# Altium schematic sheet Power.SchDoc: Наименование
size 420 x 297 mm; ApprovedBy: Сидоров; CheckedBy: Петров; Author: Иванов; CompanyName: РГППУ; Title2str: Изделия; DecimalNumber: АБВГ.123456.001 33
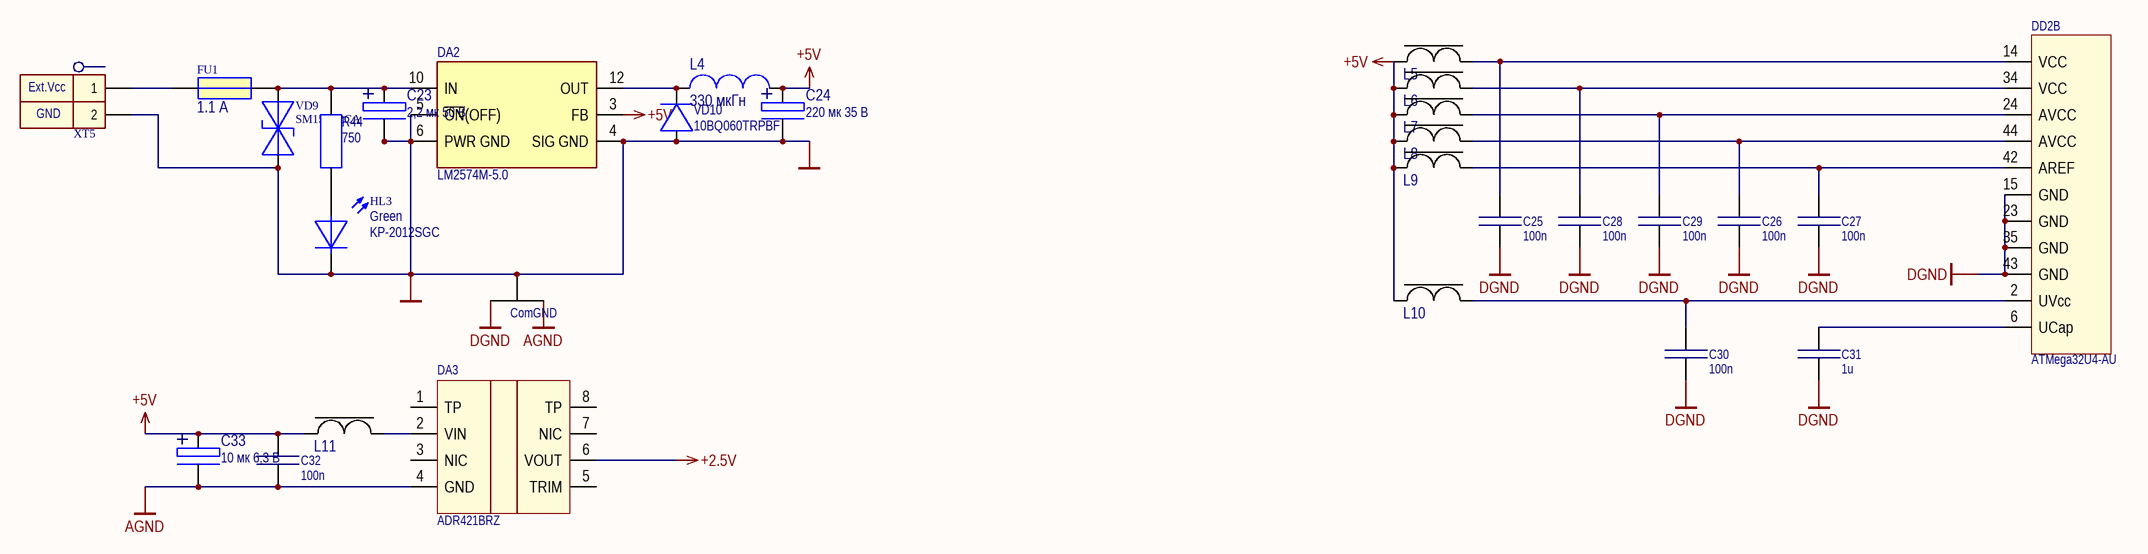
[diagram p0: Power.SchDoc]

## Parts
C23  value 2,2 мк 50 В  [CAP_POLAR_ELLYTE_B]  (hidden comment: CA050M2R20REB-0405)
C24  value 220 мк 35 В  [CAP_POLAR_ELLYTE_G]  (hidden comment: CA035M0220REG)
C25  100n  [SMDRC0805]
C26  100n  [SMDRC0805]
C27  100n  [SMDRC0805]
C28  100n  [SMDRC0805]
C29  100n  [SMDRC0805]
C30  100n  [SMDRC0805]
C31  1u  [SMDRC0805]
C32  100n  [SMDRC0805]
C33  value 10 мк 6,3 В  [К50-6]  (hidden comment: К-50-6)
DA2  LM2574M-5.0  [SOIC127P1030X264-14M]
DA3  ADR421BRZ  [SO8]
DD2  ATMega32U4-AU  [44ML_L]  (part B of 3)
FU1  value 1.1 А  [EFuse 1.1A]  (hidden comment: EFuse LP60-110F)
GND1  ComGND  [ComGND]  (net tie, no BOM)
HL3  Green  ManufacturerPartNumber: KP-2012SGC  [DIOMELF2012M]
L4  value 330 мкГн  [INDP7972X50M]  (hidden comment: SCD0705T-331K-N)
L5  MPZ1608S181A  [INDC0603X03M]  (value not drawn)
L6  MPZ1608S181A  [INDC0603X03M]  (value not drawn)
L7  MPZ1608S181A  [INDC0603X03M]  (value not drawn)
L8  MPZ1608S181A  [INDC0603X03M]  (value not drawn)
L9  MPZ1608S181A  [INDC0603X03M]  (value not drawn)
L10  MPZ1608S181A  [INDC0603X03M]  (value not drawn)
L11  MPZ1608S181A  [INDC0603X03M]  (value not drawn)
R44  750  [SMDRC0805]
VD9  SM15T12CA  [SUPRES3216X18N]
VD10  10BQ060TRPBF  [SHOTKY 4.1x3.3]
XT5  330-021-12  [330-021-12]  (value not drawn)

## Nets
+2.5V: DA3.6(VOUT)
+5V: C24.2(+) C32.2 C33.2(+) DA2.3(FB) L4.1 L5.1 L6.1 L7.1 L8.1 L9.1 L10.1 L11.2
AGND: C32.1 C33.1(-) DA3.4(GND) GND1.1
DGND: C25.2 C26.2 C27.2 C28.2 C29.2 C30.2 C31.2 DD2.15(GND) DD2.23(GND) DD2.35(GND) DD2.43(GND) GND1.3
GND: C23.1(-) C24.1(-) DA2.4(SIG_GND) DA2.5(~{ON}(OFF)) DA2.6(PWR_GND) GND1.2 HL3.2 VD9.1 VD10.A XT5.2
NetC23_2: C23.2(+) DA2.10(IN) FU1.2 R44.2 VD9.2
NetC25_1: C25.1 DD2.14(VCC) L5.2
NetC26_1: C26.1 DD2.44(AVCC) L8.2
NetC27_1: C27.1 DD2.42(AREF) L9.2
NetC28_1: C28.1 DD2.34(VCC) L6.2
NetC29_1: C29.1 DD2.24(AVCC) L7.2
NetC30_1: C30.1 DD2.2(UVcc) L10.2
NetC31_1: C31.1 DD2.6(UCap)
NetDA2_12: DA2.12(OUT) L4.2 VD10.K
NetDA3_2: DA3.2(VIN) L11.1
NetFU1_1: FU1.1 XT5.1
NetHL3_1: HL3.1 R44.1

Not connected (* = marked no-connect by the designer): DA3 1(TP) 3(NIC) 5(TRIM) 7(NIC) 8(TP)

## Notes on the sheet
- (near XT5) Ext.Vcc
- (near XT5) GND
- Изм.
- Лист
- N*докум.
- Подп.
- Дата
- Лит.
- Масса
- Масштаб
- Разраб.
- Пров.
- Т.контр.
- Лиcт
- Лиcтов
- Н.контр.
- Утв.

## Library data of the parts
C23 = 02200_050: 2,2uF 50V Polar capacitor; Manufacturer: Yageo; ManufacturerPartNumber: CA050M2R20REB-0405; Supplier: Промэлектроника; Cost: 4,11; Package: not standard; ComponentLink1Description: Datasheet; ComponentLink1URL: http://www.yageo.com/documents/recent/E-Cap_SurfaceMount_CA_2011.pdf; ComponentLink2Description: Datasheet-local; ComponentLink2URL: *
C24 = 220000_035: 220uF 35V Polar capacitor; Manufacturer: Yageo; ManufacturerPartNumber: CA035M0220REG; Supplier: Промэлектроника; Cost: 20,14; Package: not standard; ComponentLink1Description: Datasheet; ComponentLink1URL: http://www.promelec.ru/pdf/CA_2011.pdf; ComponentLink2Description: Datasheet-local; ComponentLink2URL: *
C25-C30 C32 = Capacitor 0805 100n: Generic capasitor non-polar; PartNumber: Capacitor 0805 100n; Value: 100n; ComponentLink1Description: Datasheet; Package: 0805
C31 = Capacitor 0805 1u: Generic capasitor non-polar; PartNumber: Capacitor 0805 1u; Value: 1u; ComponentLink1Description: Datasheet; Package: 0805
C33 = 10000_006-К50: 10uF 6,3V Polar through-hole cap; ManufacturerPartNumber: К-50-6; Supplier: -; Cost: -; Package: штырьевой; ComponentLink1Description: Datasheet; ComponentLink2Description: Datasheet-local
DA3 = ADR421BRZ: IC VREF SERIES 2.5V 8SOIC; Manufacturer: Analog Devices Inc.; Manufacturer Part Number: ADR421ARZ; Output Type: Fixed; Current - Output: 10mA; Tolerance: ±0.12%; Temperature Coefficient: 10ppm/°C; Noise - 0.1Hz to 10Hz: 1.75µVp-p; Voltage - Input: 4.5 V ~ 18 V; Current - Supply: 600µA; RoHS: RoHS Compliant; Category: Integrated Circuits (ICs); Packaging: Tube; Reference Type: Series; Voltage - Output (Min/Fixed): 2.5V; Voltage - Output (Max): -; Noise - 10Hz to 10kHz: -; Current - Cathode: -; Operating Temperature: -40°C ~ 125°C (TA); Mounting Type: Surface Mount; Package / Case: 8-SOIC (0.154", 3.90mm Width); Supplier Device Package: 8-SOIC; ComponentLink1URL: http://www.analog.com/media/en/technical-documentation/data-sheets/ADR420_421_423_425.pdf; ComponentLink1Description: http://www.analog.com/media/en/technical-documentation/data-sheets/ADR420_421_423_425.pdf; Supplier 1: Digi-Key; Stock 1: 2020; Pricing 1: 1=10.36, 98=8.91959, 196=7.7448, 588=6.74405, 1078=5.87385, 2548=5.6563, 5000=5.496 (USD); Supplier Part Number 1: ADR421BRZ-ND; ManufacturerPartNumber: ADR421BRZ
DD2 = ATMega32U4: ManufacturerPartNumber: ATMega32U4-AU
FU1 = EFuse LP60-110F: Fuse; ManufacturerPartNumber: EFuse LP60-110F; ComponentLink1Description: Datasheet; ComponentLink2Description: Datasheet-local; ComponentLink2URL: *
HL3 = LED1_G: Diod LED SMD Green; ComponentLink1Description: Datasheet; Cost: 2,88; ComponentLink2Description: Datasheet-local; ComponentLink2URL: *; Color: Green
L4 = SCD0705T-331K-N: Inductor; ManufacturerPartNumber: SCD0705T-331K-N; ComponentLink1Description: Datasheet; ComponentLink1URL: http://download.siliconexpert.com/pdfs/2010/12/8/6/47/4/732/yageo_/manual/inductors_smdpower_scd_2010.pdf; ComponentLink2Description: Datasheet-local; ComponentLink2URL: *
L5-L11 = Ferrite Bead: Value: ? мГн; ManufacturerPartNumber: MPZ1608S181A; ComponentLink1Description: Datasheet; Supplier: Промэлектроника; ComponentLink2Description: Datasheet-local; ComponentLink2URL: *
R44 = Resistor 0805 750: Generic resistor; PartNumber: Resistor 0805 750; Value: 750; ComponentLink1URL: http://www.mouser.com/ds/2/447/PYu-RC0402_51_RoHS_L_6_r-8721.pdf; ComponentLink1Description: Datasheet; Package: 0805
VD9 = SM15T12CA: Diod suppressor; Manufacturer: ST Microelectronics; Notes: 12 В; ComponentLink1Description: Datasheet; ComponentLink1URL: http://www.st.com/st-web-ui/static/active/en/resource/technical/document/datasheet/CD00000724.pdf; Cost: 16,73; Package: SMC/DO-214AB; Supplier: Промэлектроника; ComponentLink2Description: Datasheet-local; ComponentLink2URL: *; ManufacturerPartNumber: SM15T12CA
VD10 = 10BQ060TRPBF: DIODE SCHOTTKY 60V 1A DO214AA; Manufacturer: Vishay Semiconductor Diodes Division; Voltage - Forward (Vf) (Max) @ If: 600mV @ 1A; Current - Reverse Leakage @ Vr: 100µA @ 60V; Category: Discrete Semiconductor Products; Diode Type: Schottky; Voltage - DC Reverse (Vr) (Max): 60V; Current - Average Rectified (Io): 1A; Reverse Recovery Time (trr): -; Mounting Type: Surface Mount; Package / Case: DO-214AA, SMB; Operating Temperature - Junction: -55°C ~ 150°C; ComponentLink1URL: http://www.vishay.com/docs/94113/vs-10bq060pbf.pdf; ComponentLink1Description: http://www.vishay.com/docs/94113/vs-10bq060pbf.pdf; ManufacturerPartNumber: 10BQ060TRPBF
XT5 = Con2_D 330-021-12: Demountable connection  2-pin; Manufacturer: Degson Electronics Co., Ltd; ManufacturerPartNumber: 330-021-12; ComponentLink1Description: Datasheet; Cost: 7,45; Supplier: Промэлектроника; ComponentLink2Description: Datasheet-local
DA2 = LM2574M-5.0: ManufacturerPartNumber: LM2574M-5.0